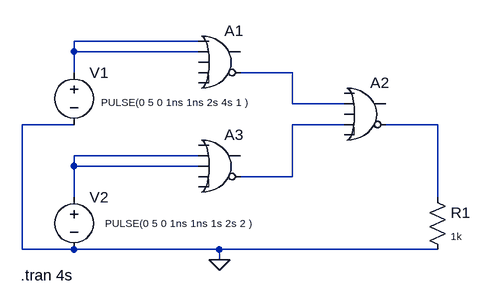
[diagram p0: schematic 207.asc]
207.asc, the LTspice schematic file:
Version 4
SHEET 1 880 680
WIRE 96 48 -96 48
WIRE -96 64 -96 48
WIRE 96 64 -96 64
WIRE -96 96 -96 64
WIRE 240 96 160 96
WIRE 240 144 240 96
WIRE 320 144 240 144
WIRE -96 176 -176 176
WIRE 320 176 240 176
WIRE 464 176 384 176
WIRE 96 224 -96 224
WIRE -96 240 -96 224
WIRE 96 240 -96 240
WIRE 240 256 240 176
WIRE 240 256 160 256
WIRE -96 288 -96 240
WIRE 464 288 464 176
WIRE -176 368 -176 176
WIRE -96 368 -176 368
WIRE 128 368 -96 368
WIRE 464 368 128 368
WIRE 128 384 128 368
FLAG 128 384 0
SYMBOL Digital\\or 128 16 R0
SYMATTR InstName A1
SYMBOL Digital\\or 352 96 R0
SYMATTR InstName A2
SYMBOL Digital\\or 128 176 R0
SYMATTR InstName A3
SYMBOL voltage -96 80 R0
WINDOW 3 42 62 Left 1
SYMATTR InstName V1
SYMATTR Value PULSE(0 5 0 1ns 1ns 2s 4s 1 )
SYMBOL voltage -96 272 R0
WINDOW 3 48 56 Left 1
SYMATTR InstName V2
SYMATTR Value PULSE(0 5 0 1ns 1ns 1s 2s 2 )
SYMBOL res 448 272 R0
WINDOW 3 36 76 Left 1
SYMATTR InstName R1
SYMATTR Value 1k
TEXT -178 408 Left 2 !.tran 4s

The netlist it stands for:
* 207.asc
A1 N001 N001 0 0 0 N002 0 0 OR
A2 0 N002 0 N003 0 N004 0 0 OR
A3 0 N005 N005 0 0 N003 0 0 OR
V1 N001 0 PULSE(0 5 0 1ns 1ns 2s 4s 1 )
V2 N005 0 PULSE(0 5 0 1ns 1ns 1s 2s 2 )
R1 N004 0 1k
.tran 4s
.backanno
.end